# Altium project ATS-1.PrjPcb
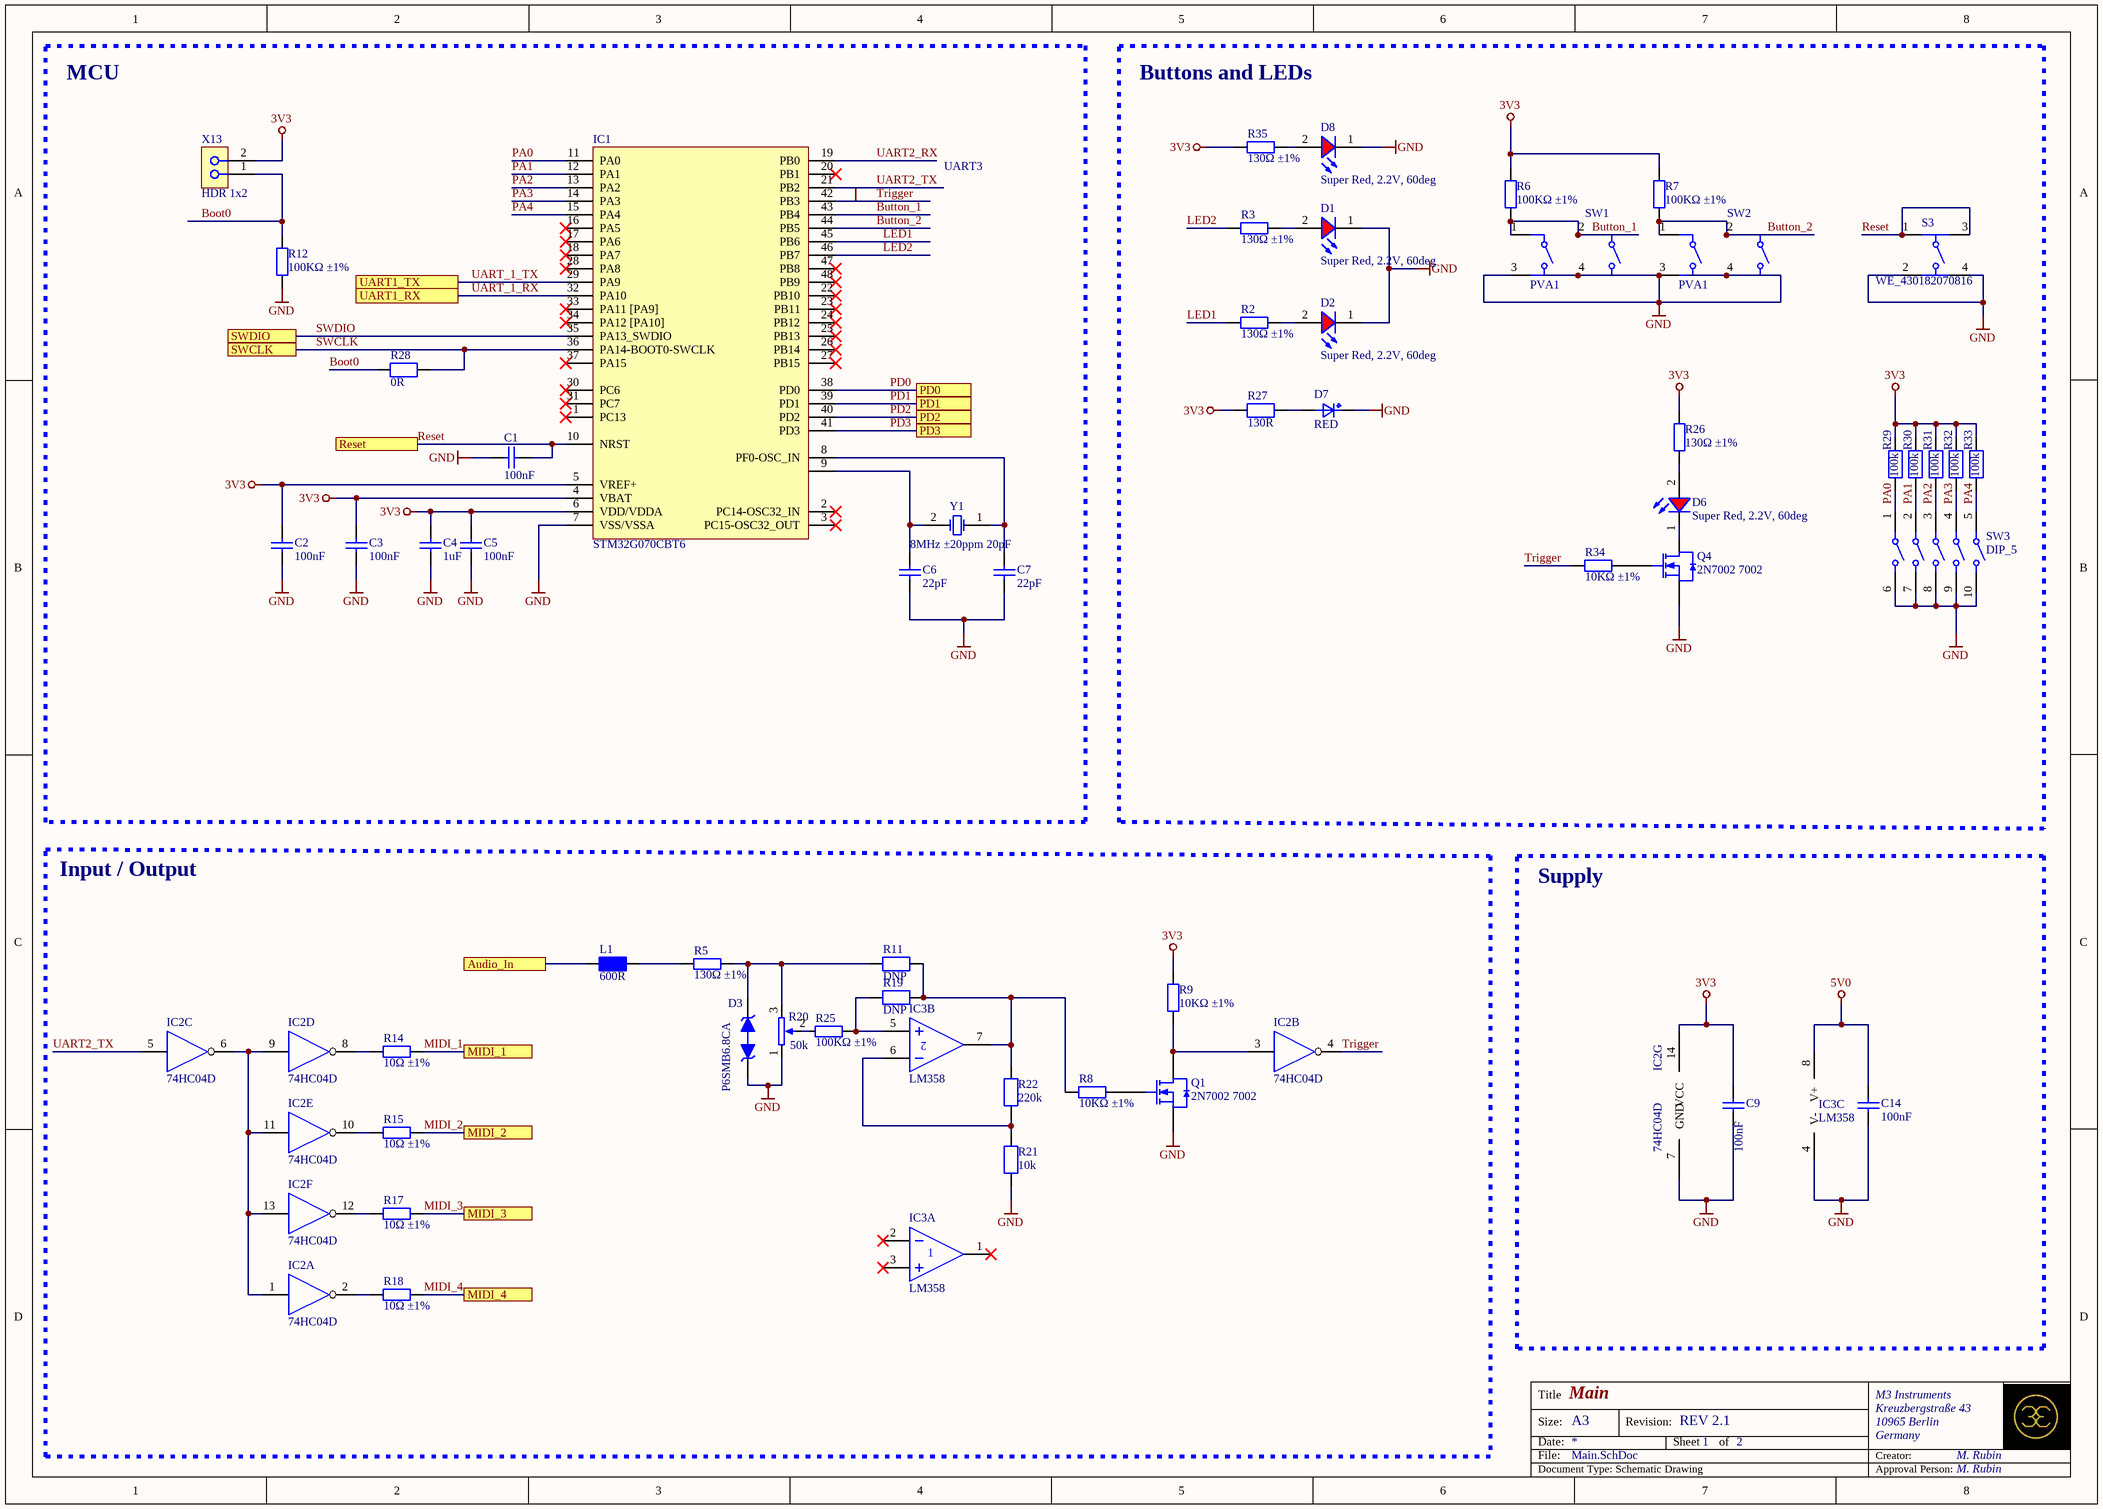
[diagram p0: Main.SchDoc]
ProjectRevision: REV 2.1; CreatorSchematic: M. Rubin; CompanyName: M3 Instruments; ApprovalSchematic: M. Rubin; Address4: Germany; Address3: 10965 Berlin; Address2: Kreuzbergstraße 43
2 sheets, 80 parts. Net scope: flat (ports and power ports of the same name join across sheets).
Board file: srn-0006.PcbDoc
Sheets:
  Main.SchDoc
  Power_and_Connectors.SchDoc

## Sheet Main.SchDoc: Main
size A3; DocumentNumber: 1; SheetNumber: 1; SheetTotal: 2

### Parts
C1  100nF  [CAPC1005X55]
C2  100nF  [CAPC1005X55]
C3  100nF  [CAPC1005X55]
C4  1uF  [CAPC1005X55]
C5  100nF  [CAPC1005X55]
C6  22pF  [0603_C]
C7  22pF  [0603_C]
C9  100nF  [0603_C]
C14  100nF  [0603_C]
D1  Super Red, 2.2V, 60deg  [WL-TMRC_3mm_17mm_space]
D2  Super Red, 2.2V, 60deg  [WL-TMRC_3mm_17mm_space]
D3  P6SMB6.8CA  [SMB(DO-214AA)_S1]
D6  Super Red, 2.2V, 60deg  [WL-TMRC_3mm_17mm_space]
D7  RED  [WL-SMCW_0805]
D8  Super Red, 2.2V, 60deg  [WL-TMRC_3mm_17mm_space]
IC1  STM32G070CBT6  [LQFP-48_7x7x05P]
IC2  74HC04D  [SOIC-14_150mil]  (parts A,B,C,D,E,F,G of 7)
IC3  LM358  [SOIC127P600X175-8N]  (parts A,B,C of 3)
L1  600R  [INDC2012X85N]
Q1  2N7002 7002  [SOT-23(SOT-23-3)]
Q4  2N7002 7002  [SOT-23(SOT-23-3)]
R2  130Ω ±1%  [0603_R]
R3  130Ω ±1%  [0603_R]
R5  130Ω ±1%  [0603_R]
R6  100KΩ ±1%  [0603_R]
R7  100KΩ ±1%  [0603_R]
R8  10KΩ ±1%  [0603_R]
R9  10KΩ ±1%  [0603_R]
R11  DNP  [RESC1608X55N]  (no BOM)
R12  100KΩ ±1%  [0603_R]
R14  10Ω ±1%  [0603_R]
R15  10Ω ±1%  [0603_R]
R17  10Ω ±1%  [0603_R]
R18  10Ω ±1%  [0603_R]
R19  DNP  [RESC1608X55N]  (no BOM)
R20  50k  [RK09K111]
R21  10k  [RESC2012X70N]
R22  220k  [RESC2012X70N]
R25  100KΩ ±1%  [0603_R]
R26  130Ω ±1%  [0603_R]
R27  130R  [RESC2012X70N]
R28  0R  [RESC2012X70N]
R29  100k  [RESC2012X70N]
R30  100k  [RESC2012X70N]
R31  100k  [RESC2012X70N]
R32  100k  [RESC2012X70N]
R33  100k  [RESC2012X70N]
R34  10KΩ ±1%  [0603_R]
R35  130Ω ±1%  [0603_R]
S3  WE_430182070816  [430182070816]
SW1  PVA1  [C&K_PVA1]
SW2  PVA1  [C&K_PVA1]
SW3  DIP_5  [HAD-05HWAG-2]
X13  HDR 1x2  [CON_HEADER2.54_1x2W]
Y1  8MHz ±20ppm 20pF  [SMD-5032_2P]

### Blocks framed on the sheet
MCU: C1-C7 IC1 R12 R28 X13 Y1
Buttons and LEDs: D1 D2 D6-D8 Q4 R2 R3 R6 R7 R26 R27 R29-R35 S3 SW1-SW3
Input / Output: D3 IC2 IC3 L1 Q1 R5 R8 R9 R11 R14 R15 R17-R22 R25
Supply: C9 C14 IC2 IC3

### Ports
Audio_In, MIDI_1, MIDI_2, MIDI_3, MIDI_4, PD0, PD1, PD2, PD3, Reset, SWCLK, SWDIO, UART1_RX, UART1_TX

### Nets
3V3: C2.2 C3.2 C4.2 C5.2 C9.2 IC1.4(VBAT) IC1.5(VREF+) IC1.6(VDD/VDDA) IC2.14(VCC) R6.2 R7.2 R9.2 R26.2 R27.1 R29.2 R30.2 R31.2 R32.2 R33.2 R35.2 X13.2
5V0: C14.2 IC3.8(V+)
GND: C1.2 C2.1 C3.1 C4.1 C5.1 C6.2 C7.2 C9.1 C14.1 D1.1(K) D2.1(K) D3.A1 D7.K D8.1(K) IC1.7(VSS/VSSA) IC2.7(GND) IC3.4(V-) Q1.2(S) Q4.2(S) R12.1 R20.1 R21.1 S3.2 S3.4 SW1.3 SW1.4 SW2.3 SW2.4 SW3.6 SW3.7 SW3.8 SW3.9 SW3.10
Boot0: R12.2 R28.1 X13.1
Button_1: IC1.43(PB4) R6.1 SW1.1 SW1.2
Button_2: IC1.44(PB5) R7.1 SW2.1 SW2.2
LED1: IC1.45(PB6) R2.2
LED2: IC1.46(PB7) R3.2
MIDI_1: R14.2 ; port MIDI_1
MIDI_2: R15.2 ; port MIDI_2
MIDI_3: R17.2 ; port MIDI_3
MIDI_4: R18.2 ; port MIDI_4
PA0: IC1.11(PA0) R29.1 SW3.1
PA1: IC1.12(PA1) R30.1 SW3.2
PA2: IC1.13(PA2) R31.1 SW3.3
PA3: IC1.14(PA3) R32.1 SW3.4
PA4: IC1.15(PA4) R33.1 SW3.5
PD0: IC1.38(PD0) ; port PD0
PD1: IC1.39(PD1) ; port PD1
PD2: IC1.40(PD2) ; port PD2
PD3: IC1.41(PD3) ; port PD3
Reset: C1.1 IC1.10(NRST) S3.1 S3.3 ; port Reset
SWCLK: IC1.36(PA14-BOOT0-SWCLK) R28.2 ; port SWCLK
SWDIO: IC1.35(PA13_SWDIO) ; port SWDIO
Trigger: IC1.42(PB3) IC2.4(Y) R34.1
UART2_RX: IC1.19(PB0)
UART2_TX: IC1.21(PB2) IC2.5(A)
UART_1_RX: IC1.32(PA10) ; port UART1_RX
UART_1_TX: IC1.29(PA9) ; port UART1_TX
NetC6_1: C6.1 IC1.9(PF1-OSC_OU'T) Y1.2(OSC2)
NetC7_1: C7.1 IC1.8(PF0-OSC_IN) Y1.1(OSC1)
NetD1_2: D1.2(A) R3.1
NetD2_2: D2.2(A) R2.1
NetD3_A2: D3.A2 R5.1 R11.2 R20.3
NetD6_1: D6.1(K) Q4.3(D)
NetD6_2: D6.2(A) R26.1
NetD7_A: D7.A R27.2
NetD8_2: D8.2(A) R35.1
NetIC2_1: IC2.1(A) IC2.6(Y) IC2.9(A) IC2.11(A) IC2.13(A)
NetIC2_2: IC2.2(Y) R18.1
NetIC2_3: IC2.3(A) Q1.3(D) R9.1
NetIC2_8: IC2.8(Y) R14.1
NetIC2_10: IC2.10(Y) R15.1
NetIC2_12: IC2.12(Y) R17.1
NetIC3_5: IC3.5(IN+) R19.2 R25.1
NetIC3_6: IC3.6(IN-) R21.2 R22.1
NetIC3_7: IC3.7(OUT) R8.1 R11.1 R19.1 R22.2
NetL1_1: L1.1 ; port Audio_In
NetL1_2: L1.2 R5.2
NetQ1_1: Q1.1(G) R8.2
NetQ4_1: Q4.1(G) R34.2
NetR20_2: R20.2 R25.2

Not connected (* = marked no-connect by the designer): IC1 1(PC13)* 2(PC14-OSC32_IN)* 3(PC15-OSC32_OUT)* 16(PA5)* 17(PA6)* 18(PA7)* 20(PB1)* 22(PB10)* 23(PB11)* 24(PB12)* 25(PB13)* 26(PB14)* 27(PB15)* 28(PA8)* 30(PC6)* 31(PC7)* 33(PA11_[PA9])* 34(PA12_[PA10])* 37(PA15)* 47(PB8)* 48(PB9)*; IC3 1(OUT)* 2(IN-)* 3(IN+)*

### Notes on the sheet
- UART3
- Title
- Size:
- Date:
- File:
- A3
- Revision:
- Sheet
- of
- Creator:
- Document Type: Schematic Drawing
- Approval Person:

### Library data of the parts
C1-C3 C5 = CAP_100nF_0402: X7R 100nF ±10% 16V 0402 Multilayer Ceramic Capacitors MLCC - SMD/SMT ROHS; Manufacturer: Samsung Electro-Mechanics; Manufacturer Part Number: CL05B104KO5NNNC; Voltage Rating: 16VDC; Alternatives allowed: yes; Tolerance: 10%; JLC: C1525
C4 = CAP_1uF_0402: X5R 25V ±10% 1uF 0402 Multilayer Ceramic Capacitors MLCC - SMD/SMT ROHS; Manufacturer: Samsung Electro-Mechanics; Manufacturer Part Number: CL05A105KA5NQNC; Alternatives allowed: yes; Voltage Rating: 25V; Tolerance: 10%; JLC: C52923
C6 C7 = 0603 22pF (220) 5% 50V: Chip capacitors; Manufacturer: Samsung Electro-Mechanics; PartNumber: CL10C220JB8NNNC; Tolerance: 5%; Voltage: 50V; ComponentLink1Description: Supplier link; ComponentLink1URL: http://www.szlcsc.com/product/details_2005.html; Package: 0603; Supplier: LC; SuppliersPartNumber: C1653; Capacitance: 22pF
C9 C14 = 0603 100nF (104) 10% 50V: Chip capacitors; Manufacturer: YAGEO; PartNumber: CC0603KRX7R9BB104; Tolerance: 10%; Voltage: 50V; ComponentLink1Description: Supplier link; ComponentLink1URL: http://www.szlcsc.com/product/details_15331.html; Package: 0603; Supplier: LC; SuppliersPartNumber: C14663; Capacitance: 100nF
D1 D2 D6 D8 = 151031SS06000_Spacer: WL-TMRC THT Mono-color Round Color, size 3mm, Super Red, 2.2V, 60deg; Luminous Intensity: 35mcd; Dominant Wavelength: 640nm; Peak Wavelength: 650nm; Chip Technology: AlGaAs; ComponentLink1Description: Manufacturer; ComponentLink1URL: http://www.we-online.de; ComponentLink2Description: Datasheet; ComponentLink2URL: https://katalog.we-online.de/led/datasheet/151031SS06000.pdf; Emitting Color: Super Red; Operating Temperature: -40 to +85degC; Mounting Technology: THT; Forward Voltage: 2.2V; Part Number: 151031SS06000; Packaging: Bulk; Published Date: October 2019; Publisher: Wurth Elektronik; Size: 3mm; Viewing Angle: 60deg
D3 = DIO_P6SMB6.8CA: TVS 6.8V; Manufacturer: Brightking Elec; Alternatives allowed: YES; Manufacturer Part Number: P6SMB6.8CA; Voltage Rating: 6.8V; JLC: C78395
D7 = LED_0805_RED_AK: Standard LEDs - SMD WL-SMCW SMDMono TpVw Waterclr 0805 Red; Manufacturer: Wurth Elektronik; Manufacturer Part Number: 150080RS75000; Voltage Rating: 2.0; Alternatives allowed: YES; JLC: C84256
IC1 = STM32G070CBT6: ARM Mikrocontroller - MCU Mainstream Value line, Arm Cortex-M0+ MCU 128 Kbytes of Flash 36 Kbytes RAM, 64; Manufacturer: STMicroelectronics; ComponentLink1Description: 供应商链接; ComponentLink1URL: http://www.szlcsc.com/product/details_9243.html; Manufacturer Part Number: STM32G070CBT6; JLC: C529338
IC2 = 74HC04D_[C5590]: 74系列逻辑芯片; ComponentLink1Description: 供应商链接; ComponentLink1URL: http://www.szlcsc.com/product/details_6041.html; Package: SOIC-14_150mil; Supplier: LC; SuppliersPartNumber: C5590
IC3 = IC_LM358DR2G: General Purpose 2 3V ~ 32V, ±1.5V ~ 16V 1.5mA 1MHz 0.6 V/us SOIC-8_150mil General Purpose Amplifiers RoHS; Manufacturer: ON Semiconductor; Alternatives allowed: NO; Manufacturer Part Number: LM358DR2G; JLC: C7950
L1 = FB_600R_600mA_0805: Ferrite Beads 0805 600 OHM; Manufacturer: Murata Electronics; Manufacturer Part Number: BLM21AG601SN1D; Lumira Part Number: MS-1042; Tolerance: 25%; Alternatives allowed: YES; JLC: C1017
Q1 Q4 = 2N7002 7002: MOS(场效应管); ComponentLink1Description: 供应商链接; ComponentLink1URL: http://www.szlcsc.com/product/details_9040.html; Package: SOT-23(SOT-23-3); Supplier: LC; SuppliersPartNumber: C8545
R2 R3 R5 R26 R35 = 0603 130R (1300) 1%: Chip resistor; Manufacturer: Uniroyal Elec; PartNumber: 0603WAF1300T5E; Power: 1/10W; ComponentLink1Description: Supplier link; ComponentLink1URL: http://www.szlcsc.com/product/details_23523.html; Package: 0603; Supplier: LC; SuppliersPartNumber: C22796; Resistance: 130Ω; Tolerance: 1%
R6 R7 R12 R25 = 0603 100K (1003) 1%: Chip resistor; Manufacturer: Uniroyal Elec; PartNumber: 0603WAF1003T5E; Power: 1/10W; ComponentLink1Description: Supplier link; ComponentLink1URL: http://www.szlcsc.com/product/details_26546.html; Package: 0603; Supplier: LC; SuppliersPartNumber: C25803; Resistance: 100KΩ; Tolerance: 1%
R8 R9 R34 = 0603 10K (1002) 1%: Chip resistor; Manufacturer: Uniroyal Elec; PartNumber: 0603WAF1002T5E; Power: 1/10W; ComponentLink1Description: Supplier link; ComponentLink1URL: http://www.szlcsc.com/product/details_26547.html; Package: 0603; Supplier: LC; SuppliersPartNumber: C25804; Resistance: 10KΩ; Tolerance: 1%
R11 R19 = RES_DNF_0603: Resistor SMD 0603 - not populated; Notes: not populated
R14 R15 R17 R18 = 0603 10R (10R0) 1%: Chip resistor; Manufacturer: Uniroyal Elec; PartNumber: 0603WAF100JT5E; Power: 1/10W; ComponentLink1Description: Supplier link; ComponentLink1URL: http://www.szlcsc.com/product/details_23586.html; Package: 0603; Supplier: LC; SuppliersPartNumber: C22859; Resistance: 10Ω; Tolerance: 1%
R20 = POT_50k_lin_small: Potentiometers 10K HOIRZONTAL; Manufacturer: Alps Alpine; Manufacturer Part Number: RK09K111-LIN10K; Tolerance: 20%
R21 = RES_10k_0805: Thick Film Resistors - SMD 1/8watt 10Kohms 1% 100ppm; Manufacturer: Vishay / Dale; Manufacturer Part Number: CRCW080510K0FKEA; Voltage Rating: 150V; Alternatives allowed: YES; Tolerance: 1%; JLC: C17414
R22 = RES_220k_0805: Thick Film Resistors - SMD 1/8watt 220Kohms 1%; Manufacturer: Vishay / Dale; Manufacturer Part Number: CRCW0805220KFKEA; Voltage Rating: 150V; Alternatives allowed: YES; Tolerance: 1%; JLC: C17556
R27 = RES_130R_0805: Dickfilmwiderstände - SMD 1/8watt 130ohms 1% 100ppm; Manufacturer: Vishay / Dale; Manufacturer Part Number: CRCW0805130RFKEA; Voltage Rating: 150V; Alternatives allowed: YES; Tolerance: 1%; JLC: C17437
R28 = RES_0R_0805: Thick Film Resistors - SMD 1/8watt ZEROohm Jumper; Manufacturer: Vishay; Manufacturer Part Number: CRCW08050000Z0EA; Voltage Rating: 150V; Tolerance: 1%; Alternatives allowed: YES; JLC: C17477
R29-R33 = RES_100k_0805: Thick Film Resistors - SMD 1/8watt 100Kohms 1% 100ppm; Manufacturer: Vishay / Dale; Manufacturer Part Number: CRCW0805100KFKEA; Voltage Rating: 150V; Alternatives allowed: YES; Tolerance: 1%; JLC: C17407
S3 = WE_430182070816: WS-TASV SMT Tact Switch 6x6mm, height 7mm, 160gf; Rated Voltage: 12VDC; Rated Current: 50mA; Washable: No; ComponentLink1Description: Manufacturer; ComponentLink1URL: http://www.we-online.de; ComponentLink2Description: Datasheet; ComponentLink2URL: https://katalog.we-online.com/em/datasheet/430182070816.pdf; Operating Temperature: -40 to +85degC; Part Number: 430182070816; Published Date: September 2019; Contact Material: Stainless Steel; Height: 7mm; Mounting Technology: SMT; Contact Plating: Silver; Operation Force: 160gf; Packaging: Tape and Reel; Terminal Material: Copper Alloy; Publisher: Wurth Elektronik; Terminal Plating: Silver
SW1 SW2 = C&K_PVA1_OA_H3_1.2N_V2: Druckschalter DPST-Schließer Tastenschalter Durchkontaktierung; Manufacturer: C&K; Manufacturer Part Number: PVA1 OA H3 1.2N V2; Alternatives allowed: NO
SW3 = DIP_HAD-05HWAG-2: SPST Black 平拨，凸起式 2.54mm 5 SMD DIP Switches ROHS; Manufacturer: Cixi Tonver Elec; Alternatives allowed: NO; Manufacturer Part Number: HAD-05HWAG-2; JLC: C4673; Manufacturer 2: CUI; Manufacturer Part Number 2: DS04-254-1-05BK-SMT
X13 = CON_HEADER_1X2: Board-to-Board-Steckverbinder, 2.54 mm, 2 Kontakt(e), Stiftleiste 1-Reihig; Manufacturer: Samtec; Manufacturer Part Number: TSW-102-07-T-S; Lumira Part Number: S-QMS-SPEC-32507; Alternatives allowed: YES
Y1 = SMD-5032_2P 8MHz 20ppm 20pF: 贴片晶振; ComponentLink1Description: 供应商链接; ComponentLink1URL: http://www.szlcsc.com/product/details_117214.html; Package: SMD-5032_2P; Supplier: LC; SuppliersPartNumber: C115962

## Sheet Power_and_Connectors.SchDoc: Power_and_Connectors
size A4; DocumentNumber: 2; SheetNumber: 2; SheetTotal: 2
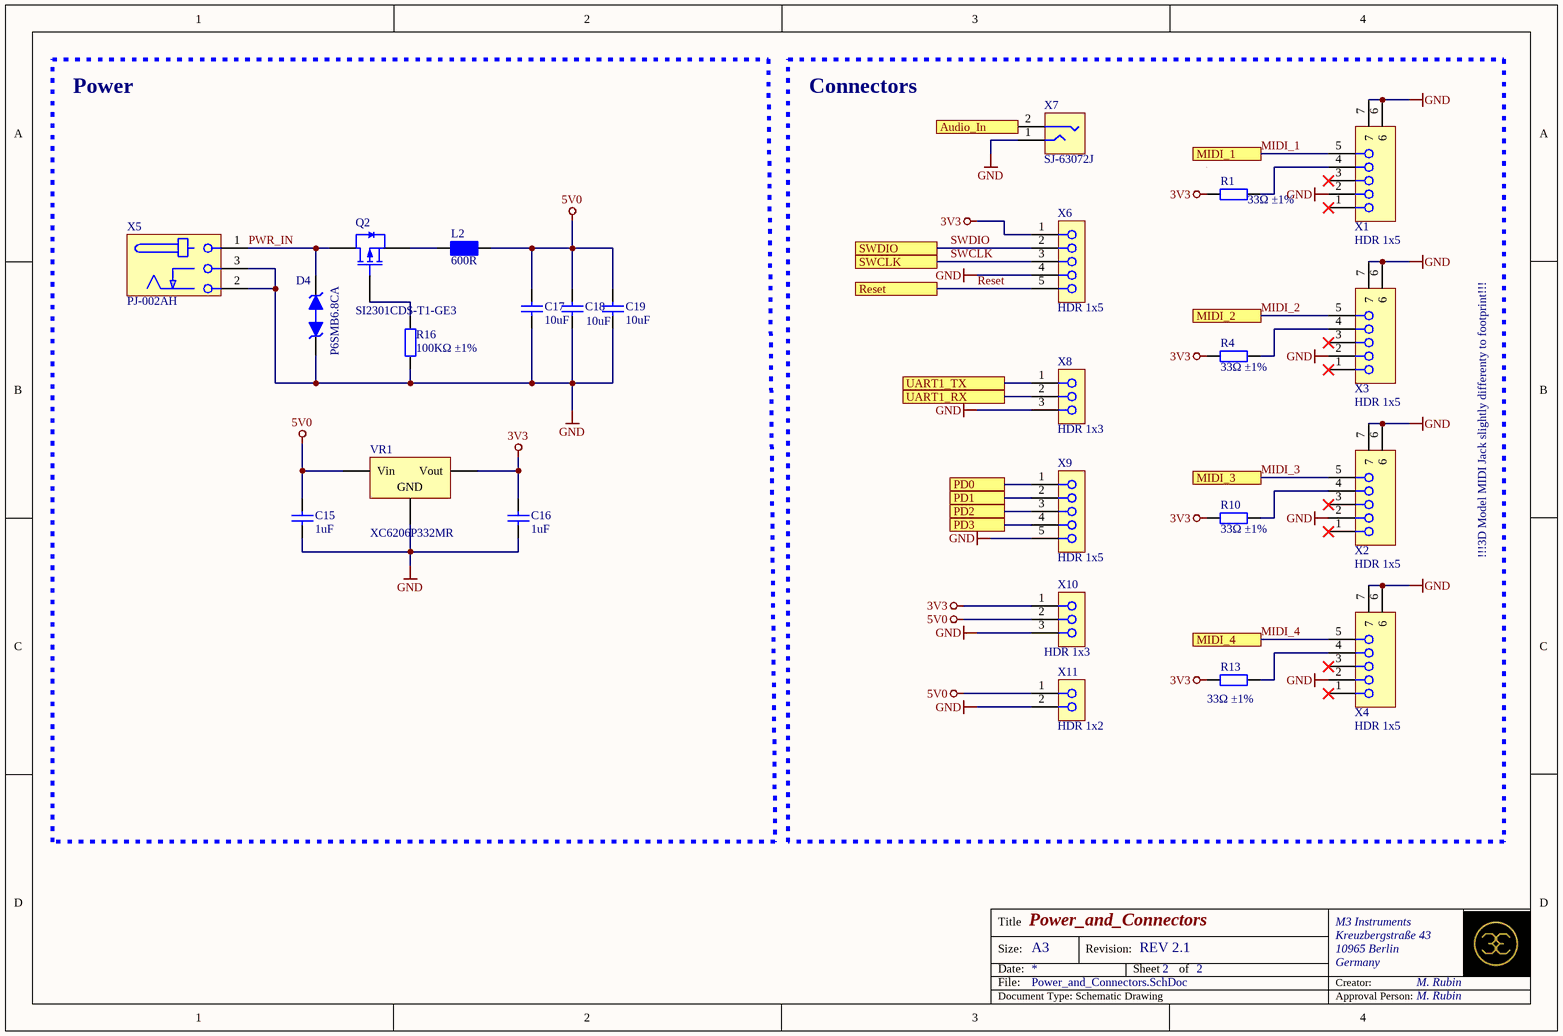
[diagram p1: Power_and_Connectors.SchDoc]

### Parts
C15  1uF  [0603_C]
C16  1uF  [0603_C]
C17  10uF  [0805_C]
C18  10uF  [0805_C]
C19  10uF  [0805_C]
D4  P6SMB6.8CA  [SMB(DO-214AA)_S1]
L2  600R  [INDC2012X85N]
Q2  SI2301CDS-T1-GE3  [SOT-23(SOT-23-3)]
R1  33Ω ±1%  [0603_R]
R4  33Ω ±1%  [0603_R]
R10  33Ω ±1%  [0603_R]
R13  33Ω ±1%  [0603_R]
R16  100KΩ ±1%  [0603_R]
VR1  XC6206P332MR  [SOT-23-3L]
X1  HDR 1x5  [MABP 5S]
X2  HDR 1x5  [MABP 5S]
X3  HDR 1x5  [MABP 5S]
X4  HDR 1x5  [MABP 5S]
X5  PJ-002AH  [PJ3L1400H110]
X6  HDR 1x5  [CON_HEADER2.54_1x5W]
X7  SJ-63072J  [CUI_SJ-63072J]
X8  HDR 1x3  [CON_HEADER2.54_1x3W]
X9  HDR 1x5  [CON_HEADER2.54_1x5W]
X10  HDR 1x3  [CON_HEADER2.54_1x3W]
X11  HDR 1x2  [CON_HEADER2.54_1x2W]

### Blocks framed on the sheet
Power: C15-C19 D4 L2 Q2 R16 VR1 X5
Connectors: R1 R4 R10 R13 X1-X4 X6-X11

### Ports
Audio_In, MIDI_1, MIDI_2, MIDI_3, MIDI_4, PD0, PD1, PD2, PD3, Reset, SWCLK, SWDIO, UART1_RX, UART1_TX

### Nets
3V3: C16.2 R1.1 R4.1 R10.1 R13.1 VR1.2(Vout) X6.1 X10.1
5V0: C15.2 C17.2 C18.2 C19.2 L2.2 VR1.3(Vin) X10.2 X11.1
GND: C15.1 C16.1 C17.1 C18.1 C19.1 D4.A1 R16.1 VR1.1(GND) X1.2 X1.6 X1.7 X2.2 X2.6 X2.7 X3.2 X3.6 X3.7 X4.2 X4.6 X4.7 X5.2 X5.3 X6.4 X7.1 X8.3 X9.5 X10.3 X11.2
MIDI_1: X1.5 ; port MIDI_1
MIDI_2: X3.5 ; port MIDI_2
MIDI_3: X2.5 ; port MIDI_3
MIDI_4: X4.5 ; port MIDI_4
PD0: X9.1 ; port PD0
PD1: X9.2 ; port PD1
PD2: X9.3 ; port PD2
PD3: X9.4 ; port PD3
PWR_IN: D4.A2 Q2.3(D) X5.1
Reset: X6.5 ; port Reset
SWCLK: X6.3 ; port SWCLK
SWDIO: X6.2 ; port SWDIO
UART_1_RX: X8.2 ; port UART1_RX
UART_1_TX: X8.1 ; port UART1_TX
NetL1_1: X7.2 ; port Audio_In
NetL2_1: L2.1 Q2.2(S)
NetQ2_1: Q2.1(G) R16.2
NetR1_2: R1.2 X1.4
NetR4_2: R4.2 X3.4
NetR10_2: R10.2 X2.4
NetR13_2: R13.2 X4.4

Not connected (* = marked no-connect by the designer): X1 1* 3*; X2 1* 3*; X3 1* 3*; X4 1* 3*

### Notes on the sheet
- !!!3D Model MIDI Jack slightly differenty to footprint!!!
- Title
- Size:
- Date:
- File:
- A3
- Revision:
- Sheet
- of
- Creator:
- Document Type: Schematic Drawing
- Approval Person:

### Library data of the parts
C15 C16 = 0603 1uF (105) 10% 50V: Chip capacitors; Manufacturer: Samsung Electro-Mechanics; PartNumber: CL10A105KB8NNNC; Tolerance: 10%; Voltage: 50V; ComponentLink1Description: Supplier link; ComponentLink1URL: http://www.szlcsc.com/product/details_16531.html; Package: 0603; Supplier: LC; SuppliersPartNumber: C15849; Capacitance: 1uF
C17-C19 = 0805 10uF (106) 10% 25V: Chip capacitors; Manufacturer: Samsung Electro-Mechanics; PartNumber: CL21A106KAYNNNE; Tolerance: 10%; Voltage: 25V; ComponentLink1Description: Supplier link; ComponentLink1URL: http://www.szlcsc.com/product/details_16532.html; Package: 0805; Supplier: LC; SuppliersPartNumber: C15850; Capacitance: 10uF
D4 = DIO_P6SMB6.8CA: as D3 on sheet Main; Manufacturer Part Number: P6SMB6.8CA; Voltage Rating: 6.8V; JLC: C78395
L2 = FB_600R_600mA_0805: as L1 on sheet Main; JLC: C1017
Q2 = SI2301CDS-T1-GE3: MOS(场效应管); ComponentLink1Description: 供应商链接; ComponentLink1URL: http://www.szlcsc.com/product/details_11030.html; Package: SOT-23(SOT-23-3); Supplier: LC; SuppliersPartNumber: C10487
R1 R4 R10 R13 = 0603 33R (33R0) 1%: Chip resistor; Manufacturer: Uniroyal Elec; PartNumber: 0603WAF330JT5E; Power: 1/10W; ComponentLink1Description: Supplier link; ComponentLink1URL: http://www.szlcsc.com/product/details_23867.html; Package: 0603; Supplier: LC; SuppliersPartNumber: C23140; Resistance: 33Ω; Tolerance: 1%
R16 = 0603 100K (1003) 1%: as R6 on sheet Main; ComponentLink1Description: Supplier link; ComponentLink1URL: http://www.szlcsc.com/product/details_26546.html; Package: 0603; Supplier: LC; SuppliersPartNumber: C25803; Resistance: 100KΩ; Tolerance: 1%
VR1 = SOT-23 XC6206P332MR: 低压差线性稳压(LDO); ComponentLink1Description: 供应商链接; ComponentLink1URL: http://www.szlcsc.com/product/details_5896.html; Package: SOT-23; Supplier: LC; SuppliersPartNumber: C5446
X1-X4 = CON_HEADER_1X5: Board-to-Board-Steckverbinder, 2.54 mm, 5 Kontakt(e), Stiftleiste 1-Reihig; Manufacturer: BKL; Alternatives allowed: NO; Manufacturer Part Number: MABP 5S
X5 = PJ-002AH: DC Power Connectors Power Jacks, Inside Contact Diameter 2mm, Outside Contact Diameter 6,5mm; Manufacturer: CUI Devices; Lumira Part Number: S-QMS-SPEC-32532; Voltage Rating: 24V; Alternatives allowed: NO; Manufacturer Part Number: PJ-002AH
X6 X9 = CON_HEADER_1X5: Board-to-Board-Steckverbinder, 2.54 mm, 5 Kontakt(e), Stiftleiste 1-Reihig; Manufacturer: Samtec; Manufacturer Part Number: TSW-105-07-T-S; Alternatives allowed: YES
X7 = Phone_Jack_1/4: Telefon-Steckverbinder 1/4"JACK HOR CHASIS CON PLSTC MNT; Manufacturer: CUI Devices; Alternatives allowed: NO; Manufacturer Part Number: SJ-63072J
X8 X10 = CON_HEADER_1X3: Board-to-Board-Steckverbinder, 2.54 mm, 3 Kontakt(e), Stiftleiste 1-Reihig; Manufacturer: Samtec; Manufacturer Part Number: TSW-103-07-T-S; Lumira Part Number: S-QMS-SPEC-32502; Alternatives allowed: YES
X11 = CON_HEADER_1X2: as X13 on sheet Main

## Nets that join several sheets
3V3: Main (21 pins), Power_and_Connectors (8 pins)
5V0: Main (C14.2 IC3.8), Power_and_Connectors (8 pins)
GND: Main (33 pins), Power_and_Connectors (28 pins)
MIDI_1: Main (R14.2), Power_and_Connectors (X1.5)
MIDI_2: Main (R15.2), Power_and_Connectors (X3.5)
MIDI_3: Main (R17.2), Power_and_Connectors (X2.5)
MIDI_4: Main (R18.2), Power_and_Connectors (X4.5)
NetL1_1: Main (L1.1), Power_and_Connectors (X7.2)
PD0: Main (IC1.38), Power_and_Connectors (X9.1)
PD1: Main (IC1.39), Power_and_Connectors (X9.2)
PD2: Main (IC1.40), Power_and_Connectors (X9.3)
PD3: Main (IC1.41), Power_and_Connectors (X9.4)
Reset: Main (C1.1 IC1.10 S3.1 S3.3), Power_and_Connectors (X6.5)
SWCLK: Main (IC1.36 R28.2), Power_and_Connectors (X6.3)
SWDIO: Main (IC1.35), Power_and_Connectors (X6.2)
UART_1_RX: Main (IC1.32), Power_and_Connectors (X8.2)
UART_1_TX: Main (IC1.29), Power_and_Connectors (X8.1)